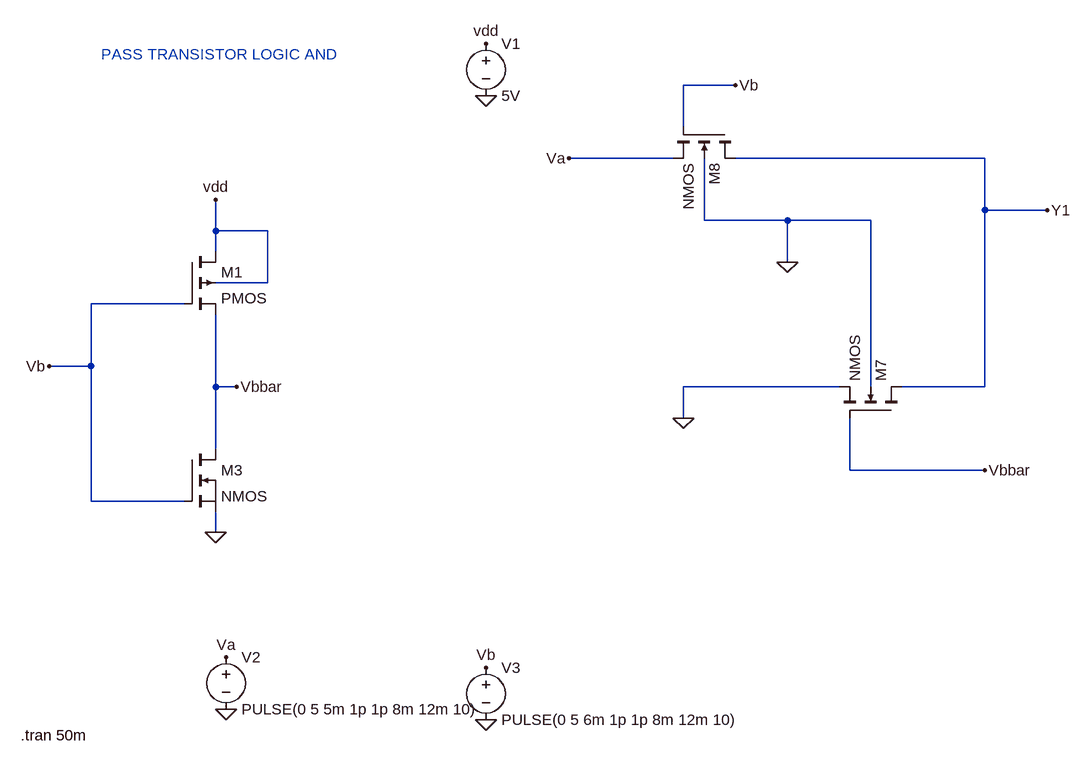
[diagram p0: schematic PASS TRANSISTOR LOGIC AND.asc]
PASS TRANSISTOR LOGIC AND.asc, the LTspice schematic file:
Version 4
SHEET 1 1052 808
WIRE 480 -208 400 -208
WIRE 400 -144 400 -208
WIRE 384 -96 224 -96
WIRE 864 -96 480 -96
WIRE 864 -16 864 -96
WIRE 960 -16 864 -16
WIRE 432 0 432 -96
WIRE 560 0 432 0
WIRE 688 0 560 0
WIRE -320 16 -320 -32
WIRE -240 16 -320 16
WIRE -320 48 -320 16
WIRE 560 64 560 0
WIRE -240 96 -240 16
WIRE -240 96 -320 96
WIRE -368 128 -512 128
WIRE -512 224 -512 128
WIRE -512 224 -576 224
WIRE -320 256 -320 144
WIRE -288 256 -320 256
WIRE 640 256 400 256
WIRE 688 256 688 0
WIRE 864 256 864 -16
WIRE 864 256 736 256
WIRE 400 304 400 256
WIRE -320 352 -320 256
WIRE 656 384 656 304
WIRE 864 384 656 384
WIRE -512 432 -512 224
WIRE -368 432 -512 432
WIRE -320 480 -320 448
FLAG -320 480 0
FLAG -320 -32 vdd
FLAG -576 224 Vb
FLAG -288 256 Vbbar
FLAG 224 -96 Va
FLAG 480 -208 Vb
FLAG 864 384 Vbbar
FLAG 960 -16 Y1
FLAG 96 -192 0
FLAG 96 -272 vdd
FLAG -304 672 Va
FLAG 96 688 Vb
FLAG -304 752 0
FLAG 96 768 0
FLAG 560 64 0
FLAG 400 304 0
SYMBOL pmos4 -368 48 R0
SYMATTR InstName M1
SYMBOL nmos -368 352 R0
SYMATTR InstName M3
SYMBOL nmos4 736 304 M270
SYMATTR InstName M7
SYMBOL nmos4 480 -144 R90
SYMATTR InstName M8
SYMBOL voltage 96 -288 R0
SYMATTR InstName V1
SYMATTR Value 5V
SYMBOL voltage -304 656 R0
WINDOW 123 0 0 Left 0
WINDOW 39 0 0 Left 0
SYMATTR InstName V2
SYMATTR Value PULSE(0 5 5m 1p 1p 8m 12m 10)
SYMBOL voltage 96 672 R0
SYMATTR InstName V3
SYMATTR Value PULSE(0 5 6m 1p 1p 8m 12m 10)
TEXT -620 792 Left 2 !.tran 50m
TEXT -496 -256 Left 2 ;PASS TRANSISTOR LOGIC AND

The netlist it stands for:
* PASS TRANSISTOR LOGIC AND.asc
M1 vdd Vb Vbbar vdd PMOS
M3 Vbbar Vb 0 0 NMOS
M7 Y1 Vbbar 0 0 NMOS
M8 Y1 Vb Va 0 NMOS
V1 vdd 0 5V
V2 Va 0 PULSE(0 5 5m 1p 1p 8m 12m 10)
V3 Vb 0 PULSE(0 5 6m 1p 1p 8m 12m 10)
.model NMOS NMOS
.model PMOS PMOS
.lib standard.mos
.tran 50m
* PASS TRANSISTOR LOGIC AND
.backanno
.end